# EAGLE design cpod-MCP1700-AM2321 (EAGLE 6.1)
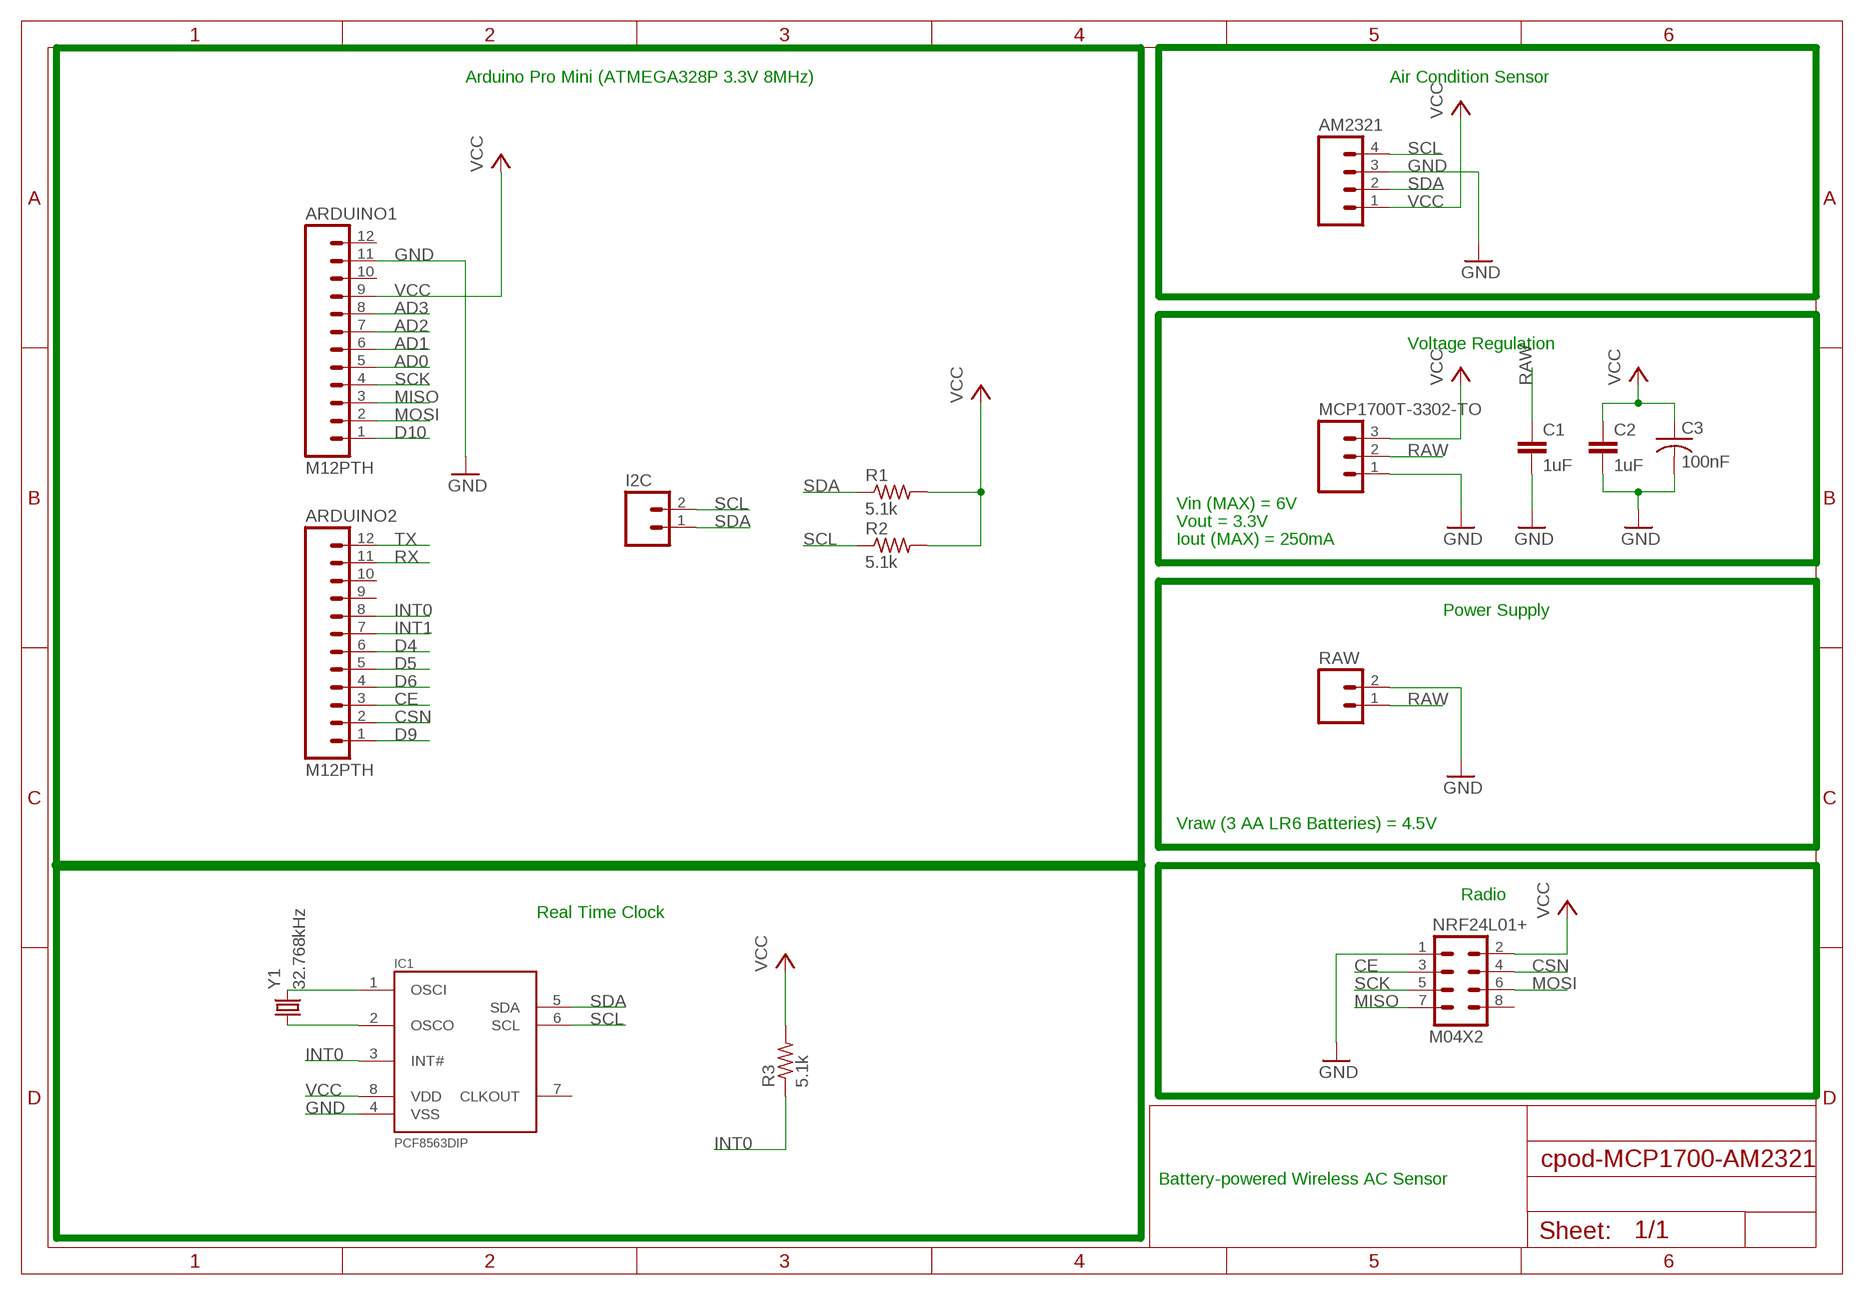
[diagram p0: schematic, sheet 1]

## Parts
AM2321  M04PTH  [1X04]
ARDUINO1  M12PTH  [1X12]
ARDUINO2  M12PTH  [1X12]
C1  1uF  CAPPTH  [CAP-PTH-SMALL]
C2  1uF  CAPPTH  [CAP-PTH-SMALL]
C3  100nF  C-US025-024X044  [C025-024X044]
I2C  M02PTH  [1X02]
IC1  PCF8563DIP  [DIL08]
MCP1700T-3302-TO  M03PTH  [1X03]
NRF24L01+  M04X2  [2X4]
R1  5.1k  R-US_0207/2V  [0207/2V]
R2  5.1k  R-US_0207/2V  [0207/2V]
R3  5.1k  R-US_0204/7  [0204/7]
RAW  M02PTH  [1X02]
Y1  32.768kHz  CRYSTALTC26H  [TC26H]

## Nets
AD0: ARDUINO1.5
AD1: ARDUINO1.6
AD2: ARDUINO1.7
AD3: ARDUINO1.8
CE: ARDUINO2.3 NRF24L01+.3
CSN: ARDUINO2.2 NRF24L01+.4
D4: ARDUINO2.6
D5: ARDUINO2.5
D6: ARDUINO2.4
D9: ARDUINO2.1
D10: ARDUINO1.1
GND: AM2321.3 ARDUINO1.11 C1.2 C2.2 C3.2 IC1.4(VSS) MCP1700T-3302-TO.1 NRF24L01+.1 RAW.2
INT0: ARDUINO2.8 IC1.3(INT#) R3.1
INT1: ARDUINO2.7
MISO: ARDUINO1.3 NRF24L01+.7
MOSI: ARDUINO1.2 NRF24L01+.6
N$4: IC1.1(OSCI) Y1.2
N$6: IC1.2(OSCO) Y1.1
RAW: C1.1 MCP1700T-3302-TO.2 RAW.1
RX: ARDUINO2.11
SCK: ARDUINO1.4 NRF24L01+.5
SCL: AM2321.4 I2C.2 IC1.6(SCL) R2.1
SDA: AM2321.2 I2C.1 IC1.5(SDA) R1.1
TX: ARDUINO2.12
VCC: AM2321.1 ARDUINO1.9 C2.1 C3.1 IC1.8(VDD) MCP1700T-3302-TO.3 NRF24L01+.2 R1.2 R2.2 R3.2
Unconnected: ARDUINO1.10 ARDUINO1.12 ARDUINO2.9 ARDUINO2.10 IC1.7(CLKOUT) NRF24L01+.8

## Notes on the sheet
- Arduino Pro Mini (ATMEGA328P 3.3V 8MHz) | Air Condition Sensor
- Voltage Regulation
- Vin (MAX) = 6V
- Vout = 3.3V
- Iout (MAX) = 250mA
- Power Supply
- Vraw (3 AA LR6 Batteries) = 4.5V
- Radio
- Real Time Clock
- Battery-powered Wireless AC Sensor

## Library data of the parts
AM2321 = SparkFun-Connectors:M04: Header 4 Standard 4-pin 0.1" header. Use with straight break away headers (SKU : PRT-00116), right angle break away headers (PRT-00553), swiss pins (PRT-00743), machine pins (PRT-00117), and female headers (PRT-00115). Molex polarized connector foot print use with SKU : PRT-08231 with associated crimp pins and housings. 1MM SMD Version SKU: PRT-10208
ARDUINO1 ARDUINO2 = SparkFun-Connectors:M12: Header 12 Standard 12-pin 0.1" header. Use with straight break away headers (SKU : PRT-00116), right angle break away headers (PRT-00553), swiss pins (PRT-00743), machine pins (PRT-00117), and female headers (PRT-00115).
C1 C2 = SparkFun-Capacitors:CAP: Capacitor Standard 0603 ceramic capacitor, and 0.1" leaded capacitor.
C3 = rcl:C-US: CAPACITOR, American symbol
I2C RAW = SparkFun-Connectors:M02: Header 2 Standard 2-pin 0.1" header. Use with straight break away headers (SKU : PRT-00116), right angle break away headers (PRT-00553), swiss pins (PRT-00743), machine pins (PRT-00117), and female headers (PRT-00115). Molex polarized connector foot print use with SKU : PRT-08233 with associated crimp pins and housings.
IC1 = CEDT:PCF8563
MCP1700T-3302-TO = SparkFun-Connectors:M03: Header 3 Standard 3-pin 0.1" header. Use with straight break away headers (SKU : PRT-00116), right angle break away headers (PRT-00553), swiss pins (PRT-00743), machine pins (PRT-00117), and female headers (PRT-00115). Molex polarized connector foot print use with SKU : PRT-08232 with associated crimp pins and housings.
NRF24L01+ = SparkFun-Connectors:M04X2: .1" header, two rows of four.
R1-R3 = rcl:R-US_: RESISTOR, American symbol
Y1 = SparkFun-FreqCtrl:CRYSTAL: Various standard crystals. Proven footprints. Spark Fun Electronics SKU : COM-00534

## Board
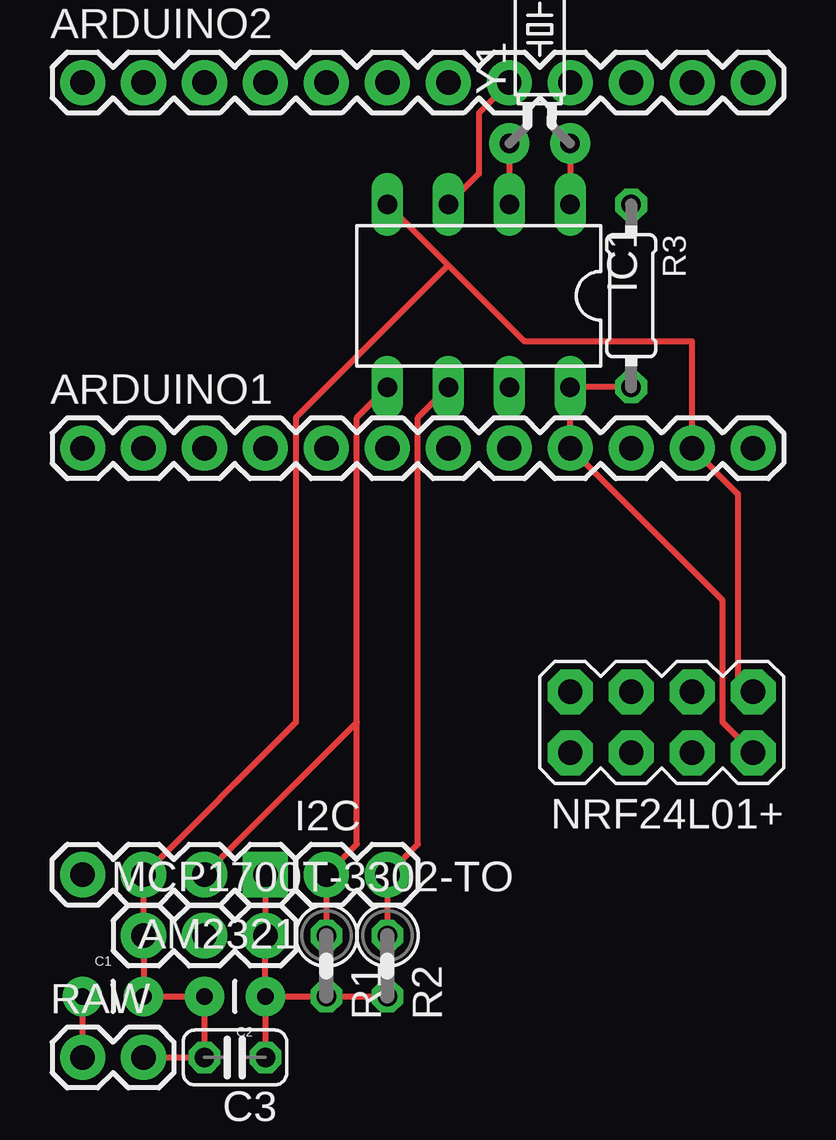
[diagram p1: board, top side]
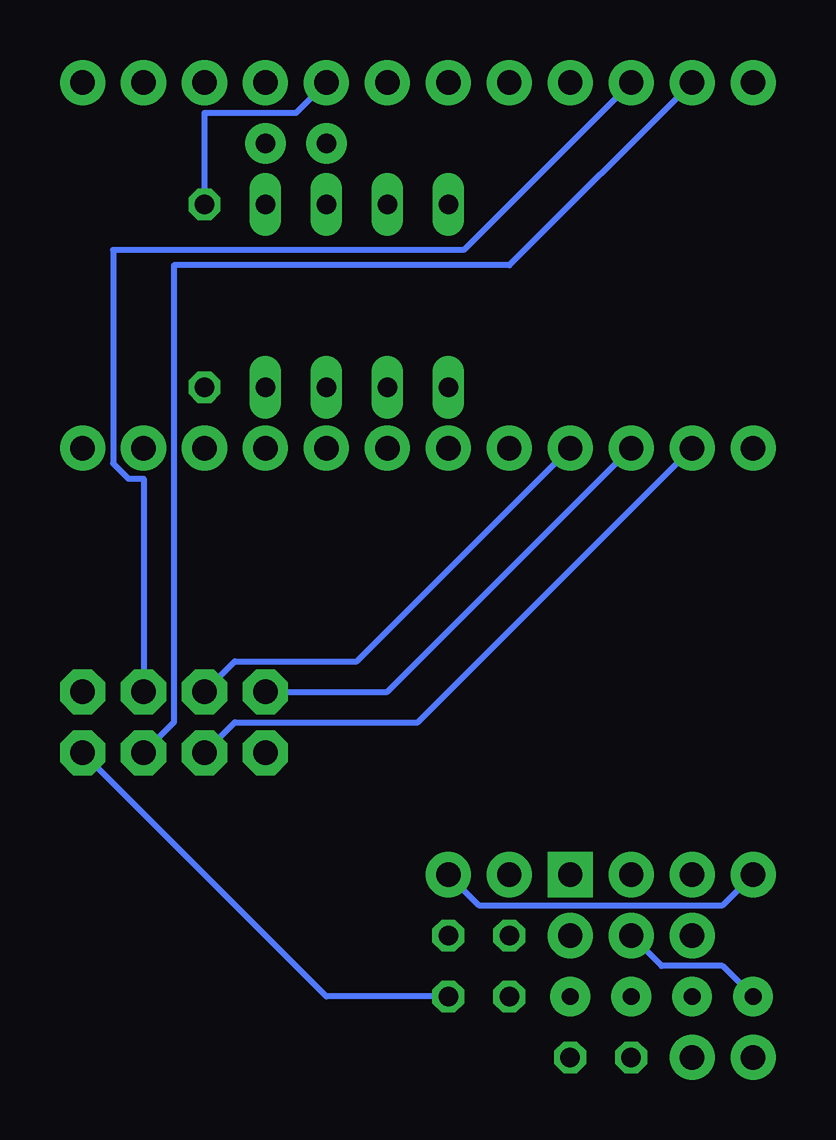
[diagram p2: board, bottom side, seen from below]

No outline drawn. Coordinates in mm, seen from the top.
Copper layers (1*16): Top 0.035mm / dielectric 1.5mm / Bottom 0.035mm
Design rules: minimum track width 10mil, minimum drill 24mil, track to track 8mil, track to pad 8mil, pad to pad 8mil, via to via 8mil, smd to smd 8mil, copper to edge 40mil, drill to drill 8mil, minimum pad ring 10mil, minimum via ring 8mil, stop-mask expansion 4mil, vias tented up to drill 0mil, thermal gap 10mil
tRestrict: area 0,-43.2 to 27.9,0; area 50.8,-43.2 to 61,-30.5; 4 lines

### Footprints (pad centres in the part's own frame; a part is rotated, then mirrored left to right if it is on the bottom)
1X04 = drill 1.016 pad 1.88 square: 1 0,0 | drill 1.016 pad 1.88: 2 2.54,0; 3 5.08,0; 4 7.62,0
1X12 = drill 1.016 pad 1.88: 1 0,0; 2 2.54,0; 3 5.08,0; 4 7.62,0; 5 10.16,0; 6 12.7,0; 7 15.24,0; 8 17.78,0; 9 20.32,0; 10 22.86,0; 11 25.4,0; 12 27.94,0
CAP-PTH-SMALL = drill 0.7 pad 1.651: 1 0,0; 2 2.54,0
C025-024X044 = drill 0.813 octagon: 1 -1.27,0; 2 1.27,0
1X02 = drill 1.016 pad 1.88: 1 0,0; 2 2.54,0
DIL08 = drill 0.813 long: 1 -3.81,-3.81; 2 -1.27,-3.81; 3 1.27,-3.81; 4 3.81,-3.81; 5 3.81,3.81; 6 1.27,3.81; 7 -1.27,3.81; 8 -3.81,3.81
1X03 = drill 1.016 pad 1.88: 1 0,0; 2 2.54,0; 3 5.08,0
2X4 = drill 1.016 pad 1.88 octagon: 1 -3.81,-1.27; 2 -3.81,1.27; 3 -1.27,-1.27; 4 -1.27,1.27; 5 1.27,-1.27; 6 1.27,1.27; 7 3.81,-1.27; 8 3.81,1.27
0207/2V = drill 0.813 octagon: 1 -1.27,0; 2 1.27,0
0204/7 = drill 0.813 octagon: 1 -3.81,0; 2 3.81,0
TC26H = drill 0.813 pad 1.676: 1 -1.27,0; 2 1.27,0

### Placement (x,y rotation side)
AM2321  39.37,-34.29 180 top
ARDUINO1  31.75,-16.51 0 top
ARDUINO2  31.75,-1.27 0 top
C1  31.75,-39.37 0 top
C2  39.37,-39.37 180 top
C3  38.1,-41.91 180 top
I2C  41.91,-34.29 0 top
IC1  48.26,-10.16 180 top
MCP1700T-3302-TO  34.29,-36.83 0 top
NRF24L01+  55.88,-27.94 180 top
R1  41.91,-38.1 270 top
R2  44.45,-38.1 270 top
R3  54.61,-10.16 270 top
RAW  31.75,-41.91 0 top
U$2  [OSHW-LOGO-L]  5.08,-38.1 0 top
Y1  50.8,-3.81 0 top

### Tracks (layer width: path | path; a pad name or v marks a point on that pad's centre or on a via)
CE
  Bottom 0.254: NRF24L01+.3 57.15,-17.78 57.78,-17.78 58.42,-17.14 58.42,-8.26 43.81,-8.26 ARDUINO2.3
CSN
  Bottom 0.254: NRF24L01+.4 55.88,-27.94 55.88,-8.89 41.91,-8.89 ARDUINO2.2
GND
  Top 0.254: RAW.2 C3.2 C2.2 C1.2 MCP1700T-3302-TO.1 AM2321.3 40.64,-27.94 40.64,-15.24 46.99,-8.89 | 46.99,-8.89 50.16,-12.06 57.15,-12.06 ARDUINO1.11 59.05,-18.41 59.05,-26.04 NRF24L01+.1 | 46.99,-8.89 IC1.4
INT0
  Top 0.254: IC1.3 48.26,-5.08 48.26,-2.54 ARDUINO2.8
  Bottom 0.254: R3.1 54.61,-2.54 50.8,-2.54 ARDUINO2.8
MISO
  Bottom 0.254: ARDUINO1.3 46.99,-26.67 NRF24L01+.7
MOSI
  Bottom 0.254: ARDUINO1.2 45.72,-27.94 53.34,-27.94 NRF24L01+.6
N$4
  Top 0.254: Y1.2 IC1.1
N$6
  Top 0.254: Y1.1 IC1.2
RAW
  Top 0.254: RAW.1 C1.1
  Bottom 0.254: MCP1700T-3302-TO.2 35.56,-38.1 33.02,-38.1 C1.1
SCK
  Bottom 0.254: ARDUINO1.4 48.26,-25.4 53.34,-25.4 NRF24L01+.5
SCL
  Top 0.254: R2.1 I2C.2 45.72,-33.02 45.72,-15.24 IC1.6
  Bottom 0.254: AM2321.4 33.02,-35.56 43.18,-35.56 I2C.2
SDA
  Top 0.254: R1.1 I2C.1 43.18,-33.02 43.18,-27.94 | IC1.5 43.18,-15.24 43.18,-27.94 | 43.18,-27.94 AM2321.2
VCC
  Top 0.254: R3.2 IC1.8 ARDUINO1.9 58.42,-22.86 58.42,-27.94 NRF24L01+.2 | AM2321.1 MCP1700T-3302-TO.3 C2.1 | C2.1 C3.1 | C2.1 R1.2 R2.2
  Bottom 0.254: NRF24L01+.2 49.53,-39.37 R2.2